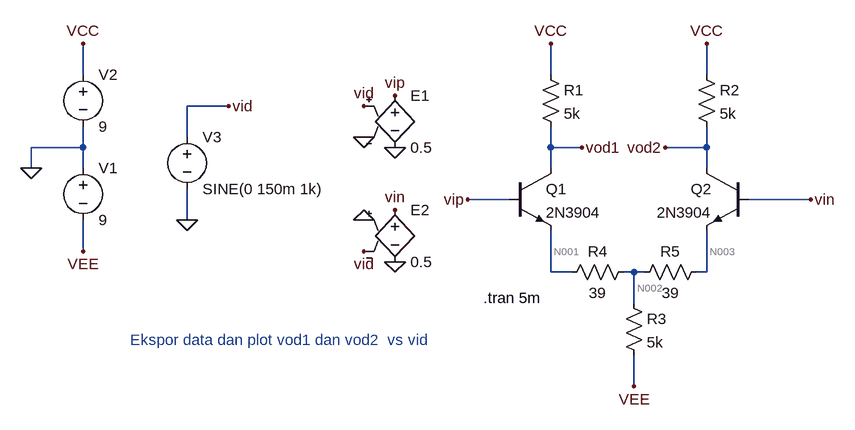
[diagram p0: schematic Perc-01-03-linearrange.asc]
Perc-01-03-linearrange.asc, the LTspice schematic file:
Version 4
SHEET 1 880 680
WIRE -320 -32 -320 -80
WIRE 400 -32 400 -80
WIRE 640 -32 640 -80
WIRE -96 16 -160 16
WIRE -160 64 -160 16
WIRE -320 80 -320 48
WIRE -320 80 -400 80
WIRE 400 80 400 48
WIRE 448 80 400 80
WIRE 640 80 640 48
WIRE 640 80 576 80
WIRE -400 112 -400 80
WIRE -320 112 -320 80
WIRE 400 112 400 80
WIRE 640 112 640 80
WIRE 336 160 272 160
WIRE 800 160 704 160
WIRE -160 192 -160 144
WIRE -320 240 -320 192
WIRE 400 272 400 208
WIRE 432 272 400 272
WIRE 528 272 512 272
WIRE 544 272 528 272
WIRE 640 272 640 208
WIRE 640 272 624 272
WIRE 528 320 528 272
WIRE 528 448 528 400
FLAG 400 -80 VCC
FLAG 640 -80 VCC
FLAG 528 448 VEE
FLAG 448 80 vod1
FLAG 576 80 vod2
FLAG -320 -80 VCC
FLAG -320 240 VEE
FLAG -400 112 0
FLAG -160 192 0
FLAG -96 16 vid
FLAG 160 80 0
FLAG 112 64 0
FLAG 112 192 0
FLAG 160 256 0
FLAG 112 16 vid
FLAG 112 240 vid
FLAG 160 0 vip
FLAG 272 160 vip
FLAG 160 176 vin
FLAG 800 160 vin
SYMBOL npn 336 112 R0
SYMATTR InstName Q1
SYMATTR Value 2N3904
SYMBOL npn 704 112 M0
SYMATTR InstName Q2
SYMATTR Value 2N3904
SYMBOL res 384 -48 R0
SYMATTR InstName R1
SYMATTR Value 5k
SYMBOL res 624 -48 R0
SYMATTR InstName R2
SYMATTR Value 5k
SYMBOL res 512 304 R0
SYMATTR InstName R3
SYMATTR Value 5k
SYMBOL voltage -320 96 R0
WINDOW 123 0 0 Left 0
WINDOW 39 0 0 Left 0
SYMATTR InstName V1
SYMATTR Value 9
SYMBOL voltage -320 -48 R0
WINDOW 123 0 0 Left 0
WINDOW 39 0 0 Left 0
SYMATTR InstName V2
SYMATTR Value 9
SYMBOL voltage -160 48 R0
WINDOW 123 0 0 Left 0
WINDOW 39 0 0 Left 0
SYMATTR InstName V3
SYMATTR Value SINE(0 150m 1k)
SYMBOL res 528 256 R90
WINDOW 0 0 56 VBottom 2
WINDOW 3 32 56 VTop 2
SYMATTR InstName R4
SYMATTR Value 39
SYMBOL res 640 256 R90
WINDOW 0 0 56 VBottom 2
WINDOW 3 32 56 VTop 2
SYMATTR InstName R5
SYMATTR Value 39
SYMBOL e 160 -16 R0
SYMATTR InstName E1
SYMATTR Value 0.5
SYMBOL e 160 160 R0
SYMATTR InstName E2
SYMATTR Value 0.5
TEXT 296 312 Left 2 !.tran 5m
TEXT -248 376 Left 2 ;Ekspor data dan plot vod1 dan vod2  vs vid

The netlist it stands for:
* Perc-01-03-linearrange.asc
Q1 vod1 vip N001 0 2N3904
Q2 vod2 vin N003 0 2N3904
R1 VCC vod1 5k
R2 VCC vod2 5k
R3 N002 VEE 5k
V1 0 VEE 9
V2 VCC 0 9
V3 vid 0 SINE(0 150m 1k)
R4 N002 N001 39
R5 N003 N002 39
E1 vip 0 vid 0 0.5
E2 vin 0 0 vid 0.5
.model NPN NPN
.model PNP PNP
.lib standard.bjt
.tran 5m
* Ekspor data dan plot vod1 dan vod2  vs vid
.backanno
.end

* Results of the author's LTspice run, read from the files saved beside the schematic
* Operating Point, zero values left out:
*   V(vod1) = 4.854 V
*   V(n001) = -649.2 mV
*   V(vod2) = 4.854 V
*   V(n003) = -649.2 mV
*   V(vcc) = 9 V
*   V(n002) = -681.7 mV
*   V(vee) = -9 V
*   Ic(Q2) = 829.2 µA
*   Ib(Q2) = 2.641 µA
*   Ie(Q2) = -831.8 µA
*   Ic(Q1) = 829.2 µA
*   Ib(Q1) = 2.641 µA
*   Ie(Q1) = -831.8 µA
*   I(R5) = 831.8 µA
*   I(R4) = -831.8 µA
*   I(R3) = 1.664 mA
*   I(R2) = 829.2 µA
*   I(R1) = 829.2 µA
*   I(E2) = -2.641 µA
*   I(E1) = -2.641 µA
*   I(V2) = -1.658 mA
*   I(V1) = -1.664 mA
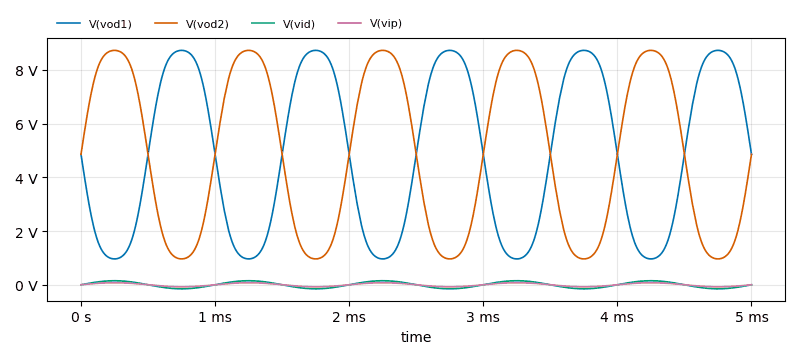
[diagram p1: Transient Analysis of Perc-01-03-linearrange.asc, plotted from the saved traces]
* Transient Analysis, 1 run:
*   V(vod1): min 962 mV, max 8.721 V, average 4.848 V, rms 5.698 V, last 4.854 V
*   V(vod2): min 962 mV, max 8.721 V, average 4.848 V, rms 5.698 V, last 4.854 V
*   V(vid): min -150 mV, max 150 mV, average 1.421 µV, rms 106.1 mV, last 0 V
*   V(vip): min -74.98 mV, max 74.98 mV, average 710.5 nV, rms 53.06 mV, last 0 V